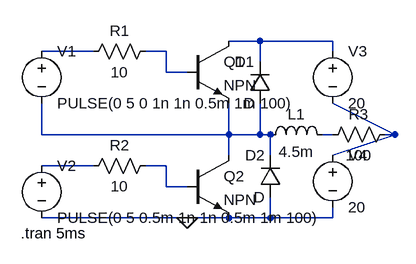
[diagram p0: schematic Inverter_RL.asc]
Inverter_RL.asc, the LTspice schematic file:
Version 4
SHEET 1 880 680
WIRE 256 128 208 128
WIRE 368 128 256 128
WIRE 0 144 -80 144
WIRE 112 144 80 144
WIRE 368 144 368 128
WIRE 256 160 256 128
WIRE 112 176 112 144
WIRE 144 176 112 176
WIRE -80 272 -80 224
WIRE 208 272 208 224
WIRE 208 272 -80 272
WIRE 256 272 256 224
WIRE 256 272 208 272
WIRE 272 272 256 272
WIRE 368 272 352 272
WIRE 464 272 368 224
WIRE 464 272 448 272
WIRE 208 304 208 272
WIRE 272 304 272 272
WIRE 368 304 464 272
WIRE 0 320 -80 320
WIRE 112 320 80 320
WIRE 112 352 112 320
WIRE 144 352 112 352
WIRE 144 400 -80 400
WIRE 208 400 144 400
WIRE 272 400 272 368
WIRE 272 400 208 400
WIRE 368 400 368 384
WIRE 368 400 272 400
FLAG 144 400 0
SYMBOL res 96 128 R90
WINDOW 0 0 56 VBottom 2
WINDOW 3 32 56 VTop 2
SYMATTR InstName R1
SYMATTR Value 10
SYMBOL res 96 304 R90
WINDOW 0 0 56 VBottom 2
WINDOW 3 32 56 VTop 2
SYMATTR InstName R2
SYMATTR Value 10
SYMBOL voltage -80 128 R0
WINDOW 123 0 0 Left 0
WINDOW 39 0 0 Left 0
SYMATTR InstName V1
SYMATTR Value PULSE(0 5 0 1n 1n 0.5m 1m 100)
SYMBOL voltage -80 304 R0
WINDOW 123 0 0 Left 0
WINDOW 39 0 0 Left 0
SYMATTR InstName V2
SYMATTR Value PULSE(0 5 0.5m 1n 1n 0.5m 1m 100)
SYMBOL voltage 368 128 R0
WINDOW 123 0 0 Left 0
WINDOW 39 0 0 Left 0
SYMATTR InstName V3
SYMATTR Value 20
SYMBOL voltage 368 288 R0
WINDOW 123 0 0 Left 0
WINDOW 39 0 0 Left 0
SYMATTR InstName V4
SYMATTR Value 20
SYMBOL npn 144 128 R0
SYMATTR InstName Q1
SYMBOL npn 144 304 R0
SYMATTR InstName Q2
SYMBOL diode 272 224 R180
WINDOW 0 24 64 Left 2
WINDOW 3 24 0 Left 2
SYMATTR InstName D1
SYMBOL diode 288 368 R180
WINDOW 0 24 64 Left 2
WINDOW 3 24 0 Left 2
SYMATTR InstName D2
SYMBOL ind 256 288 R270
WINDOW 0 32 56 VTop 2
WINDOW 3 5 56 VBottom 2
SYMATTR InstName L1
SYMATTR Value 4.5m
SYMBOL res 464 256 R90
WINDOW 0 0 56 VBottom 2
WINDOW 3 32 56 VTop 2
SYMATTR InstName R3
SYMATTR Value 100
TEXT -112 424 Left 2 !.tran 5ms

The netlist it stands for:
* Inverter_RL.asc
R1 N003 N002 10
R2 N008 N007 10
V1 N002 N004 PULSE(0 5 0 1n 1n 0.5m 1m 100)
V2 N007 0 PULSE(0 5 0.5m 1n 1n 0.5m 1m 100)
V3 N001 N006 20
V4 N006 0 20
Q1 N001 N003 N004 0 NPN
Q2 N004 N008 0 0 NPN
D1 N004 N001 D
D2 0 N004 D
L1 N004 N005 4.5m
R3 N006 N005 100
.model D D
.lib standard.dio
.model NPN NPN
.model PNP PNP
.lib standard.bjt
.tran 5ms
.backanno
.end